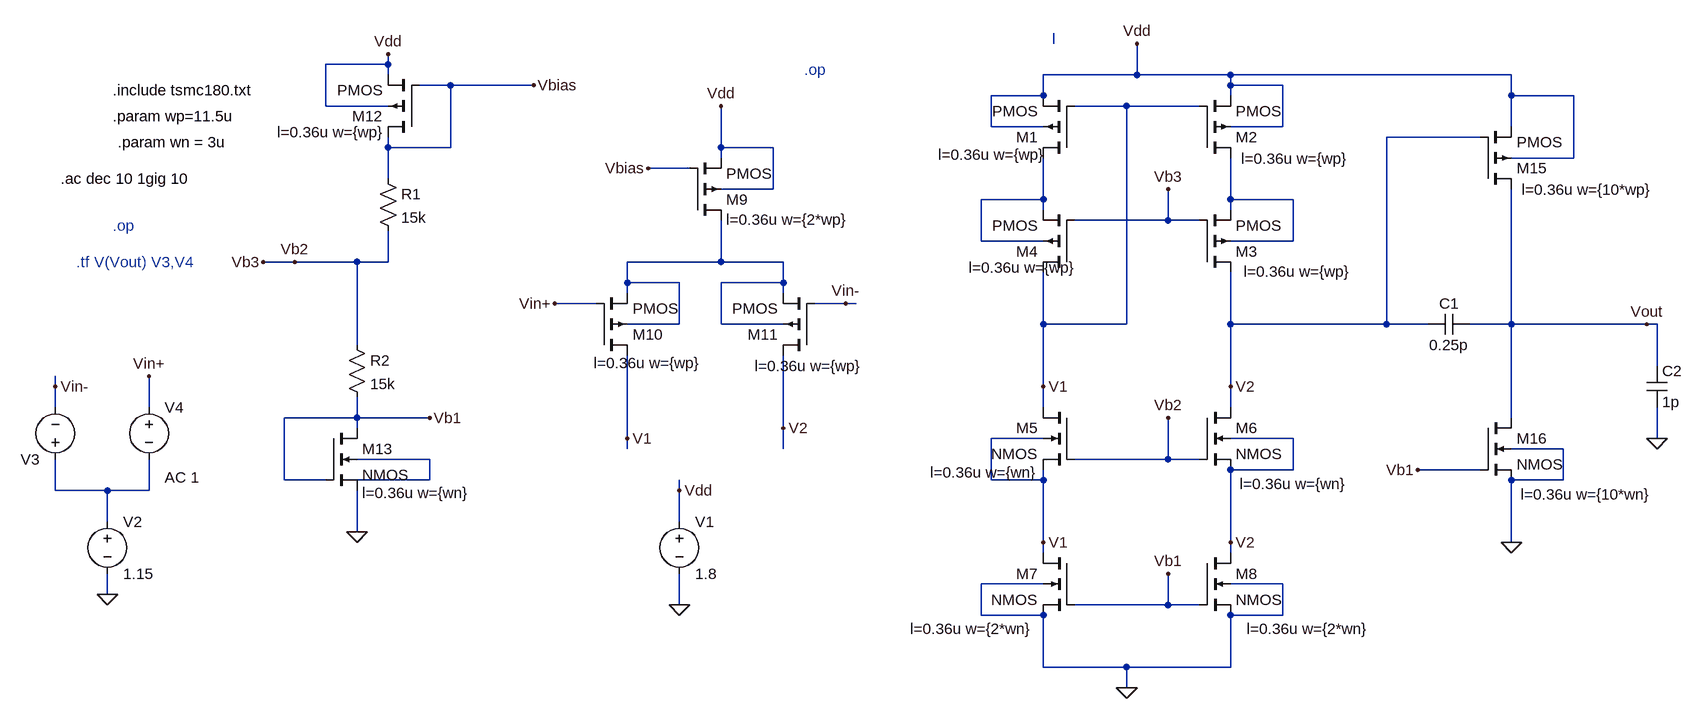
[diagram p0: schematic folded_cacode_11oct.asc]
folded_cacode_11oct.asc, the LTspice schematic file:
Version 4
SHEET 1 1224 980
WIRE 256 -96 256 -112
WIRE -768 -64 -768 -80
WIRE -768 -64 -864 -64
WIRE -768 -48 -768 -64
WIRE 384 -48 384 -96
WIRE 384 -48 240 -48
WIRE 528 -48 384 -48
WIRE 960 -48 528 -48
WIRE -672 -32 -720 -32
WIRE -544 -32 -672 -32
WIRE 528 -32 528 -48
WIRE 608 -32 528 -32
WIRE 240 -16 240 -48
WIRE 240 -16 160 -16
WIRE 528 -16 528 -32
WIRE 960 -16 960 -48
WIRE 1056 -16 960 -16
WIRE -864 0 -864 -64
WIRE -768 0 -864 0
WIRE 368 0 288 0
WIRE 480 0 368 0
WIRE 160 32 160 -16
WIRE 240 32 160 32
WIRE 608 32 608 -32
WIRE 608 32 528 32
WIRE 960 32 960 -16
WIRE 912 48 768 48
WIRE -768 64 -768 48
WIRE -672 64 -672 -32
WIRE -672 64 -768 64
WIRE -256 64 -256 0
WIRE -176 64 -256 64
WIRE -256 80 -256 64
WIRE 1056 80 1056 -16
WIRE 1056 80 960 80
WIRE -304 96 -368 96
WIRE -768 112 -768 64
WIRE -176 128 -176 64
WIRE -176 128 -256 128
WIRE 240 144 240 80
WIRE 240 144 144 144
WIRE 528 144 528 80
WIRE 624 144 528 144
WIRE 240 160 240 144
WIRE 528 160 528 144
WIRE 432 176 432 128
WIRE 432 176 288 176
WIRE 480 176 432 176
WIRE 144 208 144 144
WIRE 240 208 144 208
WIRE 624 208 624 144
WIRE 624 208 528 208
WIRE -912 240 -960 240
WIRE -816 240 -912 240
WIRE -768 240 -768 192
WIRE -768 240 -816 240
WIRE -256 240 -256 176
WIRE -256 240 -400 240
WIRE -160 240 -256 240
WIRE -400 272 -400 240
WIRE -320 272 -400 272
WIRE -160 272 -160 240
WIRE -160 272 -256 272
WIRE -400 288 -400 272
WIRE -160 288 -160 272
WIRE -448 304 -512 304
WIRE -64 304 -112 304
WIRE -48 304 -64 304
WIRE -320 336 -320 272
WIRE -320 336 -400 336
WIRE -256 336 -256 272
WIRE -160 336 -256 336
WIRE 240 336 240 256
WIRE 368 336 368 0
WIRE 368 336 240 336
WIRE 528 336 528 256
WIRE 768 336 768 48
WIRE 768 336 528 336
WIRE 832 336 768 336
WIRE 960 336 960 128
WIRE 960 336 896 336
WIRE 1168 336 960 336
WIRE 1184 336 1168 336
WIRE -816 368 -816 240
WIRE 1184 400 1184 336
WIRE -1280 432 -1280 416
WIRE 240 432 240 336
WIRE 528 432 528 336
WIRE -1280 464 -1280 432
WIRE -1136 464 -1136 416
WIRE 240 464 240 432
WIRE 528 464 528 432
WIRE -816 480 -816 448
WIRE -816 480 -928 480
WIRE -704 480 -816 480
WIRE 960 480 960 336
WIRE -816 496 -816 480
WIRE -160 496 -160 384
WIRE -400 512 -400 384
WIRE 240 512 160 512
WIRE 624 512 528 512
WIRE 1184 512 1184 464
WIRE -400 528 -400 512
WIRE -160 528 -160 496
WIRE 1040 528 960 528
WIRE -704 544 -816 544
WIRE 432 544 432 480
WIRE 432 544 288 544
WIRE 480 544 432 544
WIRE 624 560 624 512
WIRE 624 560 528 560
WIRE 912 560 816 560
WIRE -928 576 -928 480
WIRE -864 576 -928 576
WIRE -704 576 -704 544
WIRE -704 576 -816 576
WIRE 160 576 160 512
WIRE 240 576 240 560
WIRE 240 576 160 576
WIRE 1040 576 1040 528
WIRE 1040 576 960 576
WIRE -1280 592 -1280 544
WIRE -1200 592 -1280 592
WIRE -1136 592 -1136 544
WIRE -1136 592 -1200 592
WIRE -320 592 -320 576
WIRE -1200 640 -1200 592
WIRE -320 640 -320 592
WIRE -816 656 -816 592
WIRE 240 672 240 576
WIRE 528 672 528 560
WIRE 960 672 960 576
WIRE 240 688 240 672
WIRE 528 688 528 672
WIRE 240 736 144 736
WIRE 608 736 528 736
WIRE -1200 752 -1200 720
WIRE -320 768 -320 720
WIRE 432 768 432 720
WIRE 432 768 288 768
WIRE 480 768 432 768
WIRE 144 784 144 736
WIRE 240 784 144 784
WIRE 608 784 608 736
WIRE 608 784 528 784
WIRE 240 864 240 784
WIRE 368 864 240 864
WIRE 528 864 528 784
WIRE 528 864 368 864
WIRE 368 896 368 864
FLAG 368 896 0
FLAG 384 -96 Vdd
FLAG -368 96 Vbias
FLAG -320 768 0
FLAG -320 592 Vdd
FLAG -1136 416 Vin+
FLAG -1280 432 Vin-
FLAG -768 -80 Vdd
FLAG -544 -32 Vbias
FLAG -816 656 0
FLAG -704 480 Vb1
FLAG -512 304 Vin+
FLAG -64 304 Vin-
FLAG 432 480 Vb2
FLAG 432 128 Vb3
FLAG 432 720 Vb1
FLAG -1200 752 0
FLAG 816 560 Vb1
FLAG 960 672 0
FLAG 1184 512 0
FLAG -912 240 Vb2
FLAG -960 240 Vb3
FLAG 1168 336 Vout
FLAG -400 512 V1
FLAG -160 496 V2
FLAG -256 0 Vdd
FLAG 528 672 V2
FLAG 240 672 V1
FLAG 240 432 V1
FLAG 528 432 V2
DATAFLAG 528 336 ""
DATAFLAG 240 144 ""
DATAFLAG 368 0 ""
DATAFLAG 448 176 ""
DATAFLAG 432 544 ""
DATAFLAG 416 768 ""
DATAFLAG -256 240 ""
DATAFLAG 528 672 ""
DATAFLAG -784 480 ""
DATAFLAG 960 336 ""
DATAFLAG -320 96 ""
DATAFLAG -320 96 ""
DATAFLAG -320 96 ""
DATAFLAG -320 96 ""
DATAFLAG -320 96 ""
DATAFLAG -320 96 ""
DATAFLAG -320 96 ""
DATAFLAG -320 96 ""
DATAFLAG -320 96 ""
DATAFLAG -320 96 ""
DATAFLAG -320 96 ""
DATAFLAG -320 96 ""
DATAFLAG -320 96 ""
DATAFLAG 256 336 ""
DATAFLAG -640 -32 ""
DATAFLAG -816 240 ""
SYMBOL pmos4 288 80 R180
WINDOW 123 44 5 Left 2
SYMATTR Value2 l=0.36u w={wp}
SYMATTR InstName M1
SYMBOL pmos4 480 80 M180
WINDOW 123 64 -1 Left 2
SYMATTR Value2 l=0.36u w={wp}
SYMATTR InstName M2
SYMBOL pmos4 480 256 M180
WINDOW 123 68 1 Left 2
SYMATTR Value2 l=0.36u w={wp}
SYMATTR InstName M3
SYMBOL pmos4 288 256 R180
WINDOW 123 -3 7 Left 2
SYMATTR Value2 l=0.36u w={wp}
SYMATTR InstName M4
SYMBOL nmos4 288 464 M0
WINDOW 123 56 100 Left 2
SYMATTR Value2 l=0.36u w={wn}
SYMATTR InstName M5
SYMBOL nmos4 480 464 R0
WINDOW 123 62 118 Left 2
SYMATTR Value2 l=0.36u w={wn}
SYMATTR InstName M6
SYMBOL nmos4 288 688 M0
WINDOW 123 65 117 Left 2
SYMATTR Value2 l=0.36u w={2*wn}
SYMATTR InstName M7
SYMBOL nmos4 480 688 R0
WINDOW 123 73 117 Left 2
SYMATTR Value2 l=0.36u w={2*wn}
SYMATTR InstName M8
SYMBOL pmos4 -304 176 M180
WINDOW 123 56 1 Left 2
SYMATTR Value2 l=0.36u w={2*wp}
SYMATTR InstName M9
SYMBOL voltage -320 624 R0
WINDOW 123 0 0 Left 0
WINDOW 39 0 0 Left 0
SYMATTR InstName V1
SYMATTR Value 1.8
SYMBOL voltage -1280 560 R180
WINDOW 123 24 124 Left 2
WINDOW 39 0 0 Left 0
SYMATTR InstName V3
SYMATTR Value ""
SYMBOL voltage -1136 448 R0
WINDOW 123 24 124 Left 2
WINDOW 39 0 0 Left 0
SYMATTR Value2 AC 1
SYMATTR InstName V4
SYMATTR Value ""
SYMBOL pmos4 -720 48 R180
WINDOW 123 53 8 Left 2
SYMATTR Value2 l=0.36u w={wp}
SYMATTR InstName M12
SYMBOL res -784 96 R0
SYMATTR InstName R1
SYMATTR Value 15k
SYMBOL pmos4 -112 384 R180
WINDOW 123 -74 -16 Left 2
SYMATTR Value2 l=0.36u w={wp}
SYMATTR InstName M11
SYMBOL pmos4 -448 384 M180
WINDOW 123 -4 -12 Left 2
SYMATTR Value2 l=0.36u w={wp}
SYMATTR InstName M10
SYMBOL nmos4 -864 496 R0
WINDOW 123 56 100 Left 2
SYMATTR Value2 l=0.36u w={wn}
SYMATTR InstName M13
SYMBOL res -832 352 R0
SYMATTR InstName R2
SYMATTR Value 15k
SYMBOL voltage -1200 624 R0
WINDOW 123 0 0 Left 0
WINDOW 39 0 0 Left 0
SYMATTR InstName V2
SYMATTR Value 1.15
SYMBOL cap 896 320 R90
WINDOW 0 0 32 VBottom 2
WINDOW 3 32 32 VTop 2
SYMATTR InstName C1
SYMATTR Value 0.25p
SYMBOL pmos4 912 128 M180
WINDOW 123 64 -1 Left 2
SYMATTR Value2 l=0.36u w={10*wp}
SYMATTR InstName M15
SYMBOL nmos4 912 480 R0
WINDOW 123 62 118 Left 2
SYMATTR Value2 l=0.36u w={10*wn}
SYMATTR InstName M16
SYMBOL cap 1168 400 R0
SYMATTR InstName C2
SYMATTR Value 1p
TEXT -1192 -24 Left 2 !.include tsmc180.txt
TEXT -1192 16 Left 2 !.param wp=11.5u
TEXT -1184 56 Left 2 !.param wn = 3u
TEXT -128 -56 Left 2 ;.op
TEXT -1272 112 Left 2 !.ac dec 10 1gig 10
TEXT -1192 184 Left 2 ;.op
TEXT -1248 240 Left 2 ;.tf V(Vout) V3,V4

The netlist it stands for:
* folded_cacode_11oct.asc
M1 N002 V1 Vdd Vdd PMOS l=0.36u w={wp}
M2 N003 V1 Vdd Vdd PMOS l=0.36u w={wp}
M3 V2 Vb3 N003 N003 PMOS l=0.36u w={wp}
M4 V1 Vb3 N002 N002 PMOS l=0.36u w={wp}
M5 V1 Vb3 V1 V1 NMOS l=0.36u w={wn}
M6 V2 Vb3 V2 V2 NMOS l=0.36u w={wn}
M7 V1 Vb1 0 0 NMOS l=0.36u w={2*wn}
M8 V2 Vb1 0 0 NMOS l=0.36u w={2*wn}
M9 N004 Vbias Vdd Vdd PMOS l=0.36u w={2*wp}
V1 Vdd 0 1.8
V3 N006 Vin-
V4 Vin+ N006 AC 1
M12 Vbias Vbias Vdd Vdd PMOS l=0.36u w={wp}
R1 Vbias Vb3 15k
M11 V2 Vin- N004 N004 PMOS l=0.36u w={wp}
M10 V1 Vin+ N004 N004 PMOS l=0.36u w={wp}
M13 Vb1 Vb1 0 N005 NMOS l=0.36u w={wn}
R2 Vb3 Vb1 15k
V2 N006 0 1.15
C1 Vout V2 0.25p
M15 Vout V2 Vdd Vdd PMOS l=0.36u w={10*wp}
M16 Vout Vb1 0 0 NMOS l=0.36u w={10*wn}
C2 Vout 0 1p
.model NMOS NMOS
.model PMOS PMOS
.lib standard.mos
.include tsmc180.txt
.param wp=11.5u
.param wn = 3u
* .op
.ac dec 10 1gig 10
* .op
* .tf V(Vout) V3,V4
.backanno
.end